# EAGLE design honda_type1 (EAGLE 8.3.2)

## Sheet 1 of 2
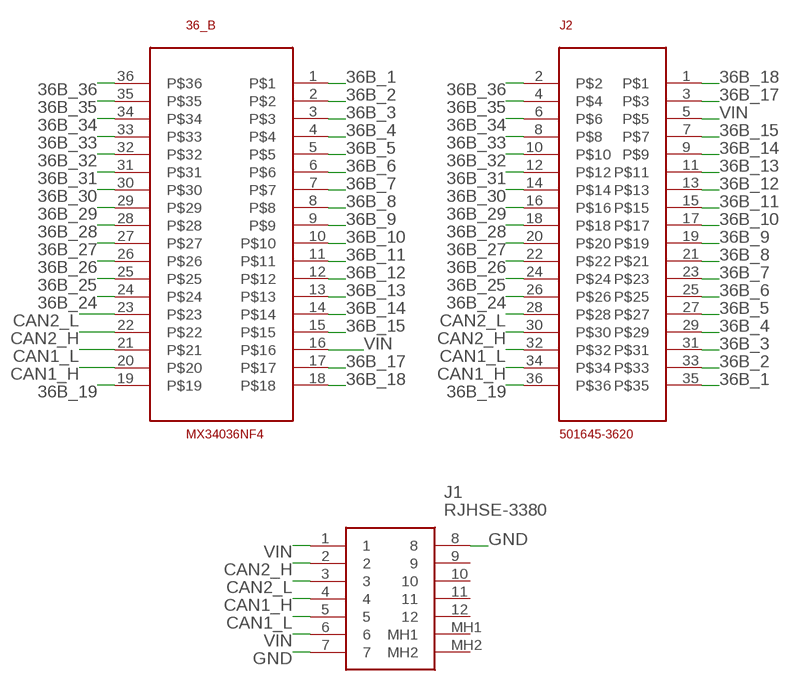
[diagram p0: schematic, sheet 1]

### Parts
36_B  MX34036NF4  [MX34036NF2]
J1  RJHSE-3380  [RJHSE3384]
J2  501645-3620  [501645-3620]

### Nets
36B_1: 36_B.1 J2.35
36B_2: 36_B.2 J2.33
36B_3: 36_B.3 J2.31
36B_4: 36_B.4 J2.29
36B_5: 36_B.5 J2.27
36B_6: 36_B.6 J2.25
36B_7: 36_B.7 J2.23
36B_8: 36_B.8 J2.21
36B_9: 36_B.9 J2.19
36B_10: 36_B.10 J2.17
36B_11: 36_B.11 J2.15
36B_12: 36_B.12 J2.13
36B_13: 36_B.13 J2.11
36B_14: 36_B.14 J2.9
36B_15: 36_B.15 J2.7
36B_17 [PWR]: 36_B.17 J2.3
36B_18: 36_B.18 J2.1
36B_19: 36_B.19 J2.36
36B_24: 36_B.24 J2.26
36B_25: 36_B.25 J2.24
36B_26: 36_B.26 J2.22
36B_27: 36_B.27 J2.20
36B_28: 36_B.28 J2.18
36B_29: 36_B.29 J2.16
36B_30: 36_B.30 J2.14
36B_31: 36_B.31 J2.12
36B_32: 36_B.32 J2.10
36B_33: 36_B.33 J2.8
36B_34 [PWR]: 36_B.34 J2.6
36B_35: 36_B.35 J2.4
36B_36: 36_B.36 J2.2
CAN1_H: 36_B.20 J1.4 J2.34
CAN1_L: 36_B.21 J1.5 J2.32
CAN2_H: 36_B.22 J1.2 J2.30
CAN2_L: 36_B.23 J1.3 J2.28
GND [PWR]: J1.7 J1.8
VIN [PWR]: 36_B.16 J1.1 J1.6 J2.5
Unconnected: J1.9 J1.10 J1.11 J1.12 J1.MH1 J1.MH2

## Sheet 2 of 2

## Library data of the parts
36_B = Souers:MX34036NF4
J1 = RJHSE-3380:RJHSE-3380: AMPHENOL ICC - RJHSE-3380 - Modular Connector, RJ45 Jack, 1 x 1 Port, 8P8C, Cat5, Through Hole Mount Source: Datasheet <https://componentsearchengine.com//RJHSE-3380.pdf>; DESCRIPTION: AMPHENOL ICC - RJHSE-3380 - Modular Connector, RJ45 Jack, 1 x 1 Port, 8P8C, Cat5, Through Hole Mount; HEIGHT: 16.26mm; MANUFACTURER_NAME: Amphenol; MANUFACTURER_PART_NUMBER: RJHSE-3380; MOUSER2_PART_NUMBER: 523-RJHSE-3380; MOUSER2_PRICE-STOCK: https://www.mouser.com/Search/Refine.aspx?Keyword=523-RJHSE-3380
J2 = Souers:501645-3620

## Net classes
1 PWR: width 0.813 mm, clearance 0.127 mm

## Board
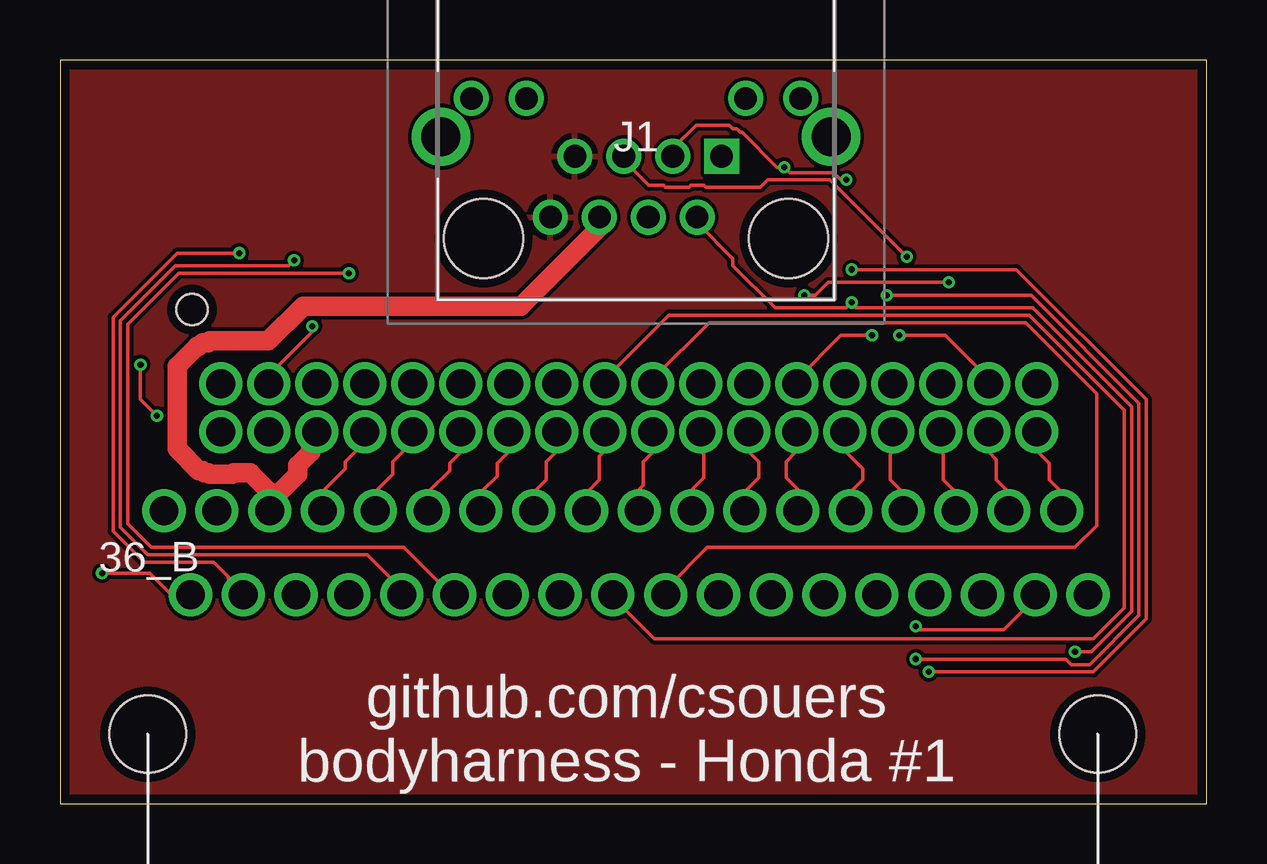
[diagram p1: board, top side]
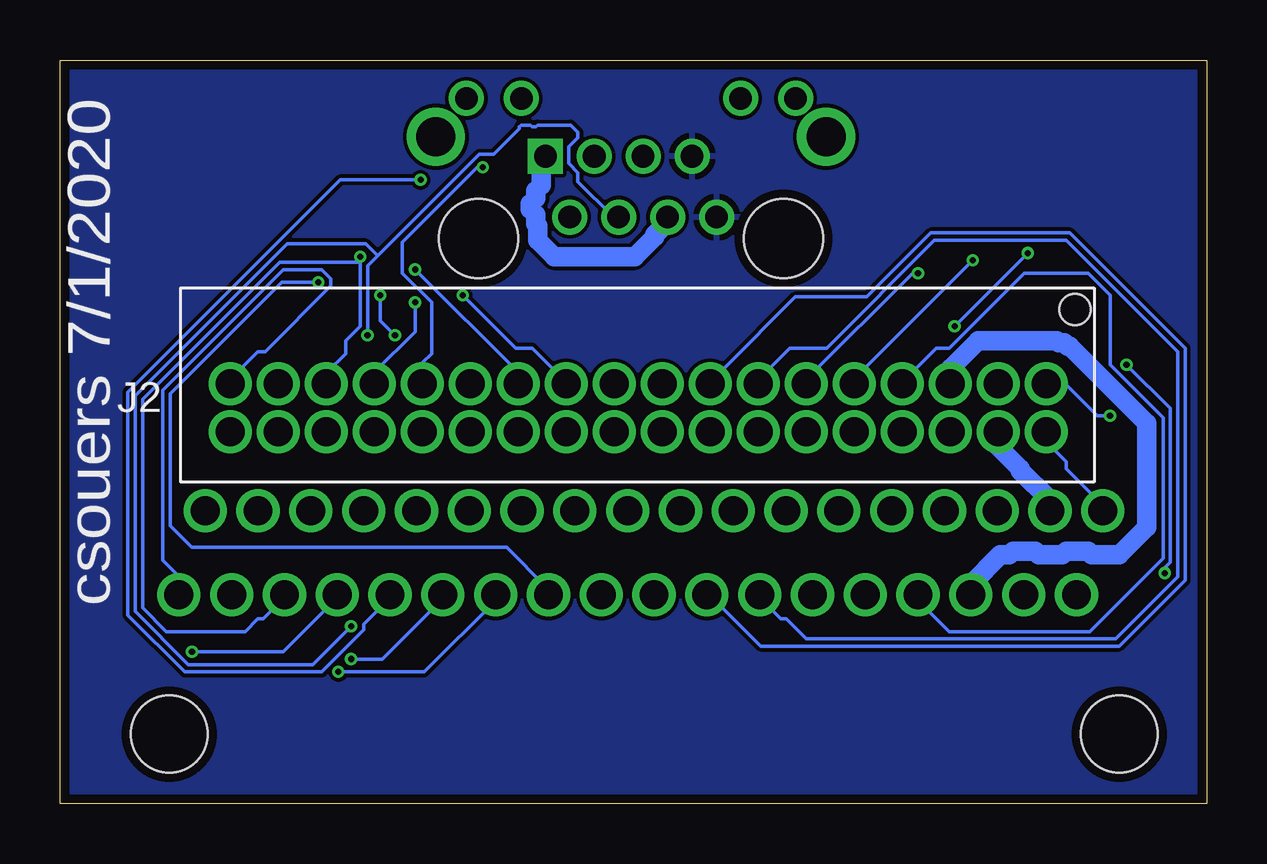
[diagram p2: board, bottom side, seen from below]

Size 47.79 x 30.98 mm. Coordinates in mm from the lower left corner, seen from the top.
Outline: 0,0 47.79,0 47.79,30.98 0,30.98 0,0
Copper layers (1*16): Top 0.035559375mm / dielectric 1.6mm / Bottom 0.035559375mm
Design rules "default *": minimum track width 6mil, minimum drill 10mil, track to track 6mil, track to pad 6mil, pad to pad 6mil, via to via 6mil, smd to smd 6mil, copper to edge 15mil, drill to drill 6mil, minimum pad ring 5mil, minimum via ring 5mil, stop-mask expansion 2.5mil, vias tented up to drill 0mil, thermal gap 10mil

### Footprints (pad centres in the part's own frame; a part is rotated, then mirrored left to right if it is on the bottom)
MX34036NF2 = drill 1.2: 1 19.8,0; 2 17.6,0; 3 15.4,0; 4 13.2,0; 5 11,0; 6 8.8,0; 7 6.6,0; 8 4.4,0; 9 2.2,0; 10 0,0; 11 -2.2,0; 12 -4.4,0; 13 -6.6,0; 14 -8.8,0; 15 -11,0; 16 -13.2,0; 17 -15.4,0; 18 -17.6,0; 19 20.9,-3.5; 20 18.7,-3.5; 21 16.5,-3.5; 22 14.3,-3.5; 23 12.1,-3.5; 24 9.9,-3.5; 25 7.7,-3.5; 26 5.5,-3.5; 27 3.3,-3.5; 28 1.1,-3.5; 29 -1.1,-3.5; 30 -3.3,-3.5; 31 -5.5,-3.5; 32 -7.7,-3.5; 33 -9.9,-3.5; 34 -12.1,-3.5; 35 -14.3,-3.5; 36 -16.5,-3.5 | hole 3.2: 21.3,-9.3; -18.282,-9.3
RJHSE3384 = drill 0.94 pad 1.462 square: 1 3.57,5.97 | drill 0.94 pad 1.462: 2 2.55,3.43; 3 1.53,5.97; 4 0.51,3.43; 5 -0.51,5.97; 6 -1.53,3.43; 7 -2.55,5.97; 8 -3.57,3.43; 9 6.86,8.38; 10 4.57,8.38; 11 -4.57,8.38; 12 -6.86,8.38 | drill 1.62 pad 2.43: MH1 -8.13,6.78; MH2 8.13,6.78 | hole 3.3: -6.35,2.54; 6.35,2.54
501645-3620 = drill 1.2: 1 -20,1; 2 -20,-1; 3 -18,1; 4 -18,-1; 5 -16,1; 6 -16,-1; 7 -14,1; 8 -14,-1; 9 -12,1; 10 -12,-1; 11 -10,1; 12 -10,-1; 13 -8,1; 14 -8,-1; 15 -6,1; 16 -6,-1; 17 -4,1; 18 -4,-1; 19 -2,1; 20 -2,-1; 21 0,1; 22 0,-1; 23 2,1; 24 2,-1; 25 4,1; 26 4,-1; 27 6,1; 28 6,-1; 29 8,1; 30 8,-1; 31 10,1; 32 10,-1; 33 12,1; 34 12,-1; 35 14,1; 36 14,-1 | hole 1.3: -21.2,-4.1

### Placement (x,y rotation side)
36_B  21.94,12.19 0 top
J1  24,21 0 top
J2  26.7,16.49 180 bottom

### Tracks (layer width: path | path; a pad name or v marks a point on that pad's centre or on a via)
36B_1
  Top 0.152: 36_B.1 41.68,12.27 41.68,13.03 41.22,13.49 41.22,14.17 40.77,14.63 40.77,15.47 J2.35
36B_2
  Top 0.152: 36_B.2 39.47,12.27 39.47,13.03 39.01,13.49 39.01,14.33 38.71,14.63 38.71,15.47 J2.33
36B_3
  Top 0.152: 36_B.3 37.26,12.27 37.26,13.03 36.8,13.49 36.8,14.55 36.73,14.63 36.73,15.47 J2.31
36B_4
  Top 0.152: 36_B.4 35.13,12.27 35.13,12.95 34.59,13.49 34.59,14.55 34.67,14.63 34.67,15.47 J2.29
36B_5
  Top 0.152: 36_B.5 32.99,12.27 32.99,13.03 33.45,13.49 33.45,13.95 32.77,14.63 32.77,15.47 J2.27
36B_6
  Top 0.152: 36_B.6 30.71,12.27 30.71,13.11 30.25,13.56 30.25,14.25 30.63,14.63 30.63,15.47 J2.25
36B_7
  Top 0.152: 36_B.7 28.57,12.27 28.57,13.03 29.11,13.56 29.11,14.25 28.73,14.63 28.73,15.47 J2.23
36B_8
  Top 0.152: 36_B.8 26.36,12.27 26.36,13.11 26.82,13.56 26.82,14.55 26.75,14.63 26.75,15.47 J2.21
36B_9
  Top 0.152: 36_B.9 24.16,12.27 24.16,13.11 24.31,13.26 24.31,14.25 24.69,14.63 24.69,15.47 J2.19
36B_10
  Top 0.152: 36_B.10 21.95,12.27 21.95,12.95 22.48,13.49 22.48,14.48 22.63,14.63 22.63,15.47 J2.17
36B_11
  Top 0.152: 36_B.11 19.81,12.27 19.81,13.03 20.27,13.49 20.27,14.25 20.65,14.63 20.65,15.47 J2.15
36B_12
  Top 0.152: 36_B.12 17.6,12.27 17.6,13.03 18.21,13.64 18.21,14.17 18.67,14.63 18.67,15.47 J2.13
36B_13
  Top 0.152: 36_B.13 15.39,12.27 15.39,13.03 16.23,13.87 16.23,14.17 16.69,14.63 16.69,15.47 J2.11
36B_14
  Top 0.152: 36_B.14 13.18,12.27 13.18,13.03 13.87,13.72 13.87,14.25 14.63,15.01 14.63,15.47 J2.9
36B_15
  Top 0.152: 36_B.15 10.97,12.27 10.97,13.03 11.89,13.95 11.89,14.25 12.65,15.01 12.65,15.47 J2.7
36B_17
  Bottom 0.813: 36_B.17 6.55,12.27 6.55,12.65 7.77,13.87 7.77,13.95 8.76,14.94 8.76,15.47 J2.3
36B_18
  Bottom 0.152: 36_B.18 4.34,12.27 4.34,12.42 5.87,13.95 5.87,14.25 6.63,15.01 6.63,15.47 J2.1
36B_19
  Bottom 0.152: 36_B.19 42.9,8.76 42.9,9.53 43.51,10.13 43.51,17.22 38.48,22.25 36.88,22.25 36.5,21.87 36.5,21.57 39.24,18.82 39.55,18.82 40.69,17.68 40.69,17.53 J2.36
36B_24  (via drill 0.25)
  Top 0.152: v35.66,6.02 41.91,6.02 42.14,5.79 42.9,5.79 44.96,7.85 44.96,16.69 40.46,21.18 v34.44,21.18 | v33.83,19.51 32.54,19.51 30.71,17.68 30.71,17.53 J2.26
  Bottom 0.152: v35.66,6.02 34.37,6.02 31.85,8.53 31.85,8.69 36_B.24 | v34.44,21.18 34.44,20.12 v33.83,19.51
36B_25  (via drill 0.25)
  Top 0.152: v36.2,5.49 43.05,5.49 45.26,7.7 45.26,16.84 39.85,22.25 v32.99,22.25
  Bottom 0.152: v36.2,5.49 32.61,5.49 29.64,8.46 36_B.25 | v32.99,22.25 28.73,17.98 28.73,17.53 J2.24
36B_26  (via drill 0.25)
  Top 0.152: v37.03,21.72 32,21.72 31.47,21.18 v31.01,21.18
  Bottom 0.152: v37.03,21.72 38.56,21.72 43.2,17.07 43.2,11.58 42.29,10.67 29.18,10.67 27.51,8.99 27.51,8.76 36_B.26 | v31.01,21.18 28.8,18.97 28.12,18.97 26.67,17.53 J2.22
36B_27
  Top 0.152: 36_B.27 25.3,8.76 25.3,8.99 26.98,10.67 42.29,10.67 43.2,11.58 43.2,17.07 40.23,20.04 27.05,20.04 24.77,17.75 24.77,17.53 J2.20
36B_28
  Top 0.152: J2.18 22.71,17.53 22.71,17.68 25.38,20.34 40.39,20.34 44.35,16.38 44.35,8.15 43.05,6.86 24.77,6.86 23.09,8.53 23.09,8.69 36_B.28
36B_29
  Bottom 0.152: J2.16 20.65,17.53 20.12,18.06 20.12,18.14 17.14,21.11 14.17,21.11 11.51,23.77 5.71,23.77 0.91,18.97 0.91,9.3 3.66,6.55 18.59,6.55 20.8,8.76 36_B.29
36B_30
  Bottom 0.152: 36_B.30 18.59,8.69 18.59,8.53 17.75,7.7 17.53,7.7 16.69,6.86 3.81,6.86 1.22,9.45 1.22,18.82 5.87,23.47 11.35,23.47 15.85,18.97 17.37,18.97 18.67,17.68 18.67,17.53 J2.14
36B_31  (via drill 0.25)
  Top 0.152: v12.04,22.1 4.95,22.1 2.82,19.96 2.82,11.66 3.81,10.67 14.33,10.67 16.23,8.76 16.38,8.76 36_B.31
  Bottom 0.152: v12.04,22.1 12.27,22.1 16.69,17.68 16.69,17.53 J2.12
36B_32  (via drill 0.25)
  Top 0.152: v9.75,22.63 9.53,22.4 4.8,22.4 2.52,20.12 2.52,11.51 3.66,10.36 12.8,10.36 14.17,8.99 14.17,8.76 36_B.32
  Bottom 0.152: v9.75,22.63 14.63,17.75 14.63,17.53 J2.10
36B_33
  Bottom 0.152: 36_B.33 11.96,8.69 11.96,8.38 10.74,7.16 4.88,7.16 1.83,10.21 1.83,16.08 4.04,18.29 4.04,21.18 4.95,22.1 7.62,22.1 10.74,18.97 11.28,18.97 12.72,17.53 J2.8
36B_34
  Bottom 0.813: 36_B.34 9.83,8.76 9.83,9.14 8.61,10.36 8.23,10.36 8.08,10.52 7.16,10.52 7.01,10.36 6.02,10.36 5.87,10.52 4.95,10.52 4.8,10.36 3.66,10.36 2.52,11.51 2.52,15.85 5.71,19.05 5.79,19.05 5.94,19.2 6.17,19.2 6.25,19.28 9.53,19.28 10.67,18.14 10.59,18.06 10.67,17.98 10.67,17.53 J2.6
36B_35  (via drill 0.25)
  Top 0.152: v7.47,22.94 4.88,22.94 2.21,20.27 2.21,11.35 3.5,10.06 6.4,10.06 7.01,9.45 7.01,9.37 7.62,8.76 36_B.35 | v10.52,19.89 10.52,19.66 8.76,17.91 8.76,17.53 J2.4
  Bottom 0.152: v10.52,19.89 v7.47,22.94
36B_36  (via drill 0.25)
  Top 0.152: v1.75,9.6 3.73,9.6 4.57,8.76 5.41,8.76 36_B.36 | v3.35,18.29 3.35,16.84 v4.04,16.15
  Bottom 0.152: v1.75,9.6 1.75,9.83 1.52,10.06 1.52,16.46 v3.35,18.29 | v4.04,16.15 4.57,16.15 5.87,17.45 6.63,17.45 J2.2
CAN1_H  (via drill 0.25)
  Top 0.152: v34.98,19.51 36.88,19.51 38.63,17.75 38.63,17.53 J2.34 | v35.66,7.39 35.81,7.24 39.32,7.24 40.62,8.53 40.62,8.69 36_B.20
  Bottom 0.152: 34.56,22.82 34.98,22.4 v34.98,19.51 | 34.56,22.82 30.33,27.05 29.72,27.05 28.65,28.12 28.65,28.19 28.57,28.27 28.19,28.27 28.12,28.19 27.96,28.19 27.89,28.27 26.52,28.27 26.21,27.96 26.21,27.74 26.59,27.36 26.59,26.67 26.21,26.29 26.21,25.91 24.77,24.46 24.54,24.46 J1.4 | v35.66,7.39 37.26,5.79 42.44,5.79 44.65,8 44.65,16.99 38.33,23.32 35.05,23.32 34.56,22.82
CAN1_L  (via drill 0.25)
  Top 0.152: v35.28,22.78 32.08,25.98 29.49,25.98 29.18,25.68 26.9,25.68 26.82,25.76 26.29,25.76 26.21,25.68 25.22,25.68 25.15,25.76 24.54,25.76 23.55,26.75 23.55,26.9 J1.5
  Bottom 0.152: 35.28,22.55 35.28,19.89 35.89,19.28 35.89,18.75 36.65,17.98 36.65,17.53 J2.32 | 35.28,22.55 38.63,22.55 44.35,16.84 44.35,8.15 43.36,7.16 40.08,7.16 39.55,7.7 39.32,7.7 38.48,8.53 38.48,8.69 36_B.21 | 35.28,22.55 v35.28,22.78
CAN2_H  (via drill 0.25)
  Top 0.152: J1.2 26.59,24.38 26.59,24.16 28.04,22.71 28.04,22.4 29.79,20.65 32.77,20.65 v32.99,20.88 32.99,20.8 33.15,20.65 40.54,20.65 44.65,16.54 44.65,8 42.98,6.33 v42.29,6.33
  Bottom 0.152: v32.99,20.88 32.99,19.66 34.67,17.98 34.67,17.53 J2.30 | v42.29,6.33 38.48,6.33 36.27,8.53 36.27,8.69 36_B.22
CAN2_L  (via drill 0.25)
  Top 0.152: J1.3 25.6,26.98 25.6,27.36 26.52,28.27 27.89,28.27 28.04,28.12 28.19,28.12 28.35,27.96 28.42,27.96 29.87,26.52 v30.18,26.52 30.4,26.29 32.23,26.29 32.54,25.98 v32.77,25.98
  Bottom 0.152: v30.18,26.52 30.4,26.52 33.53,23.39 33.53,22.1 32.31,20.88 32.31,18.75 32.69,18.36 32.69,17.53 J2.28 | v32.77,25.98 36.12,25.98 44.96,17.14 44.96,7.85 42.6,5.49 36.88,5.49 35.13,7.24 35.13,7.47 34.06,8.53 34.06,8.69 36_B.23
GND
  pour Bottom: 47.8,0 47.8,31 0,31 0,0
  pour Top: 0,31 0,0 47.8,0 47.8,31
VIN
  Top 0.813: J2.5 10.67,15.47 10.67,15.01 10.44,14.78 10.44,14.63 9.91,14.1 9.91,13.72 8.76,12.57 8.76,12.27 36_B.16 8.69,13.03 7.92,13.79 7.24,13.79 7.16,13.72 6.25,13.72 6.17,13.79 6.02,13.79 5.94,13.87 5.79,13.87 4.88,14.78 4.88,18.21 5.71,19.05 5.79,19.05 5.94,19.2 6.17,19.2 6.25,19.28 8.69,19.28 10.13,20.73 19.2,20.73 22.55,24.08 22.55,24.31 22.48,24.38 J1.6
  Bottom 0.813: J1.6 22.48,24.38 22.48,24.23 23.01,23.7 23.01,23.62 23.85,22.78 27.2,22.78 27.89,23.47 27.89,24.08 27.96,24.16 27.96,24.54 28.19,24.77 28.19,24.99 27.96,25.22 27.96,25.53 27.74,25.76 27.74,26.75 27.58,26.9 J1.1

### Text on the board
tPlace: github.com/csouers / bodyharness - Honda #1
bPlace: csouers 7/1/2020